# EAGLE design LED6Channels (EAGLE 6.5.0)
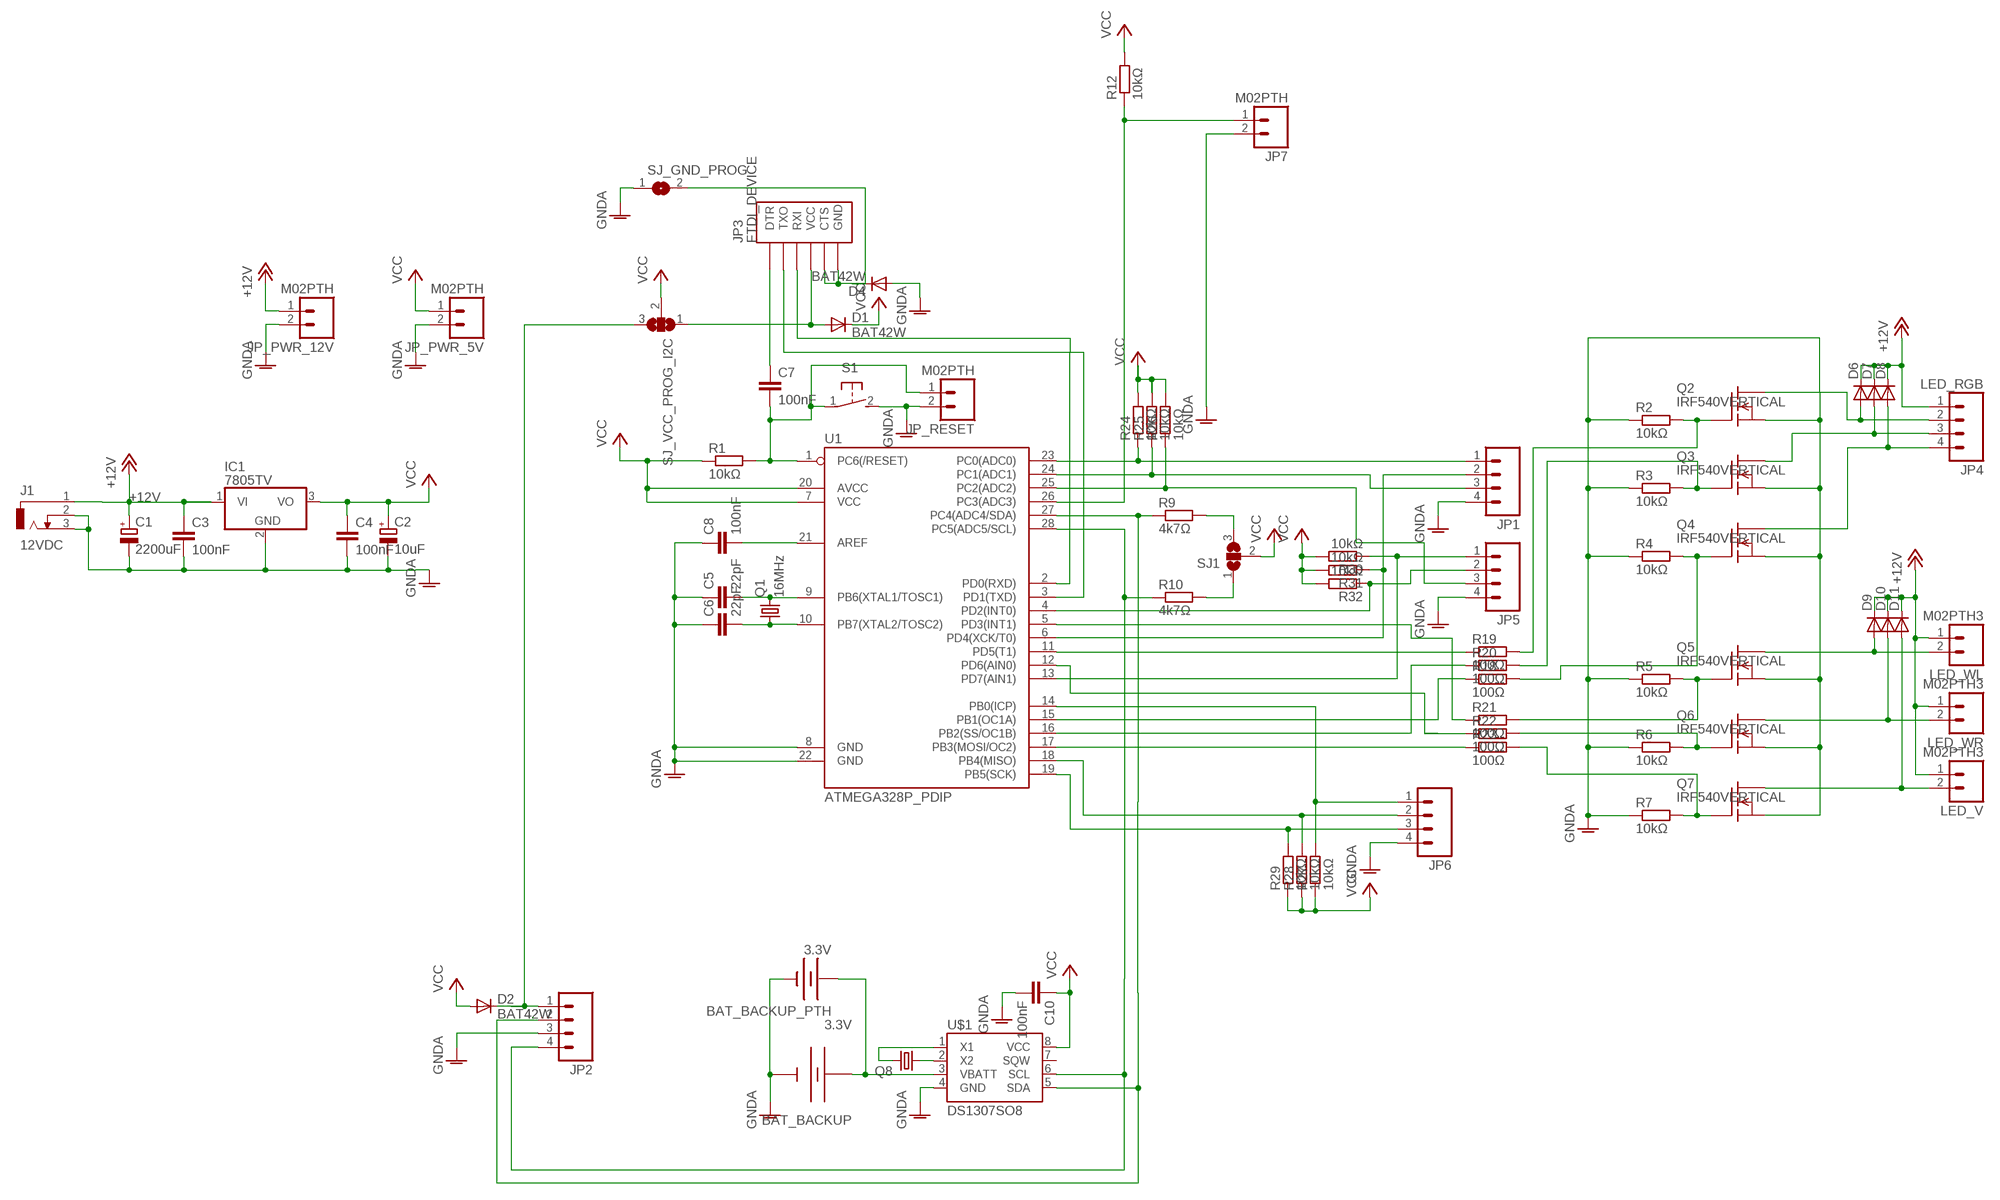
[diagram p0: schematic, sheet 1]

## Parts
BAT_BACKUP  3.3V  BATTERYNOVIAS  [S8421-45R-NOVIAS]
BAT_BACKUP_PTH  3.3V  BATTERY20PTH  [BATTCOM_20MM_PTH]
C1  2200uF  CPOL-EUE5-13  [E5-13]
C2  10uF  CPOL-EUE2-5  [E2-5]
C3  100nF  C-EU025-024X044  [C025-024X044]
C4  100nF  C-EU025-024X044  [C025-024X044]
C5  22pF  C-EU025-024X044  [C025-024X044]
C6  22pF  C-EU025-024X044  [C025-024X044]
C7  100nF  C-EU025-024X044  [C025-024X044]
C8  100nF  C-EU025-024X044  [C025-024X044]
C10  100nF  C-EU025-024X044  [C025-024X044]
D1  BAT42W  DIODE-SOD123  [SOD123]
D2  BAT42W  DIODE-SOD123  [SOD123]
D4  BAT42W  DIODE-SOD123  [SOD123]
D6  DIODE-DO201-05V  [DO201AD-05V]
D7  DIODE-DO201-05V  [DO201AD-05V]
D8  DIODE-DO201-05V  [DO201AD-05V]
D9  DIODE-DO201-05V  [DO201AD-05V]
D10  DIODE-DO201-05V  [DO201AD-05V]
D11  DIODE-DO201-05V  [DO201AD-05V]
IC1  7805TV  [TO220V]
J1  12VDC  DCJ0303  [DCJ0303]
JP1  M04LONGPADS  [1X04_LONGPADS]
JP2  M04LONGPADS  [1X04_LONGPADS]
JP3  FTDI_DEVICE  [FTDI_DEVICE_SIDE]
JP4  LED_RGB  M04LONGPADS  [1X04_LONGPADS]
JP5  M04LONGPADS  [1X04_LONGPADS]
JP6  M04LONGPADS  [1X04_LONGPADS]
JP7  M02PTH  [1X02]
JP_PWR_5V  M02PTH  [1X02]
JP_PWR_12V  M02PTH  [1X02]
JP_RESET  M02PTH  [1X02]
LED_V  M02PTH3  [1X02_LONGPADS]
LED_WL  M02PTH3  [1X02_LONGPADS]
LED_WR  M02PTH3  [1X02_LONGPADS]
Q1  16MHz  CRYSTALHC49S  [HC49/S]
Q2  IRF540VERTICAL  [TO220V]
Q3  IRF540VERTICAL  [TO220V]
Q4  IRF540VERTICAL  [TO220V]
Q5  IRF540VERTICAL  [TO220V]
Q6  IRF540VERTICAL  [TO220V]
Q7  IRF540VERTICAL  [TO220V]
Q8  CRYSTALTC26H  [TC26H]
R1  10kΩ  R-EU_0207/10  [0207/10]
R2  10kΩ  R-EU_0207/10  [0207/10]
R3  10kΩ  R-EU_0207/10  [0207/10]
R4  10kΩ  R-EU_0207/10  [0207/10]
R5  10kΩ  R-EU_0207/10  [0207/10]
R6  10kΩ  R-EU_0207/10  [0207/10]
R7  10kΩ  R-EU_0207/10  [0207/10]
R9  4k7Ω  R-EU_0207/10  [0207/10]
R10  4k7Ω  R-EU_0207/10  [0207/10]
R12  10kΩ  R-EU_0207/10  [0207/10]
R18  100Ω  R-EU_0207/10  [0207/10]
R19  100Ω  R-EU_0207/10  [0207/10]
R20  100Ω  R-EU_0207/10  [0207/10]
R21  100Ω  R-EU_0207/10  [0207/10]
R22  100Ω  R-EU_0207/10  [0207/10]
R23  100Ω  R-EU_0207/10  [0207/10]
R24  10kΩ  R-EU_0207/10  [0207/10]
R25  10kΩ  R-EU_0207/10  [0207/10]
R26  10kΩ  R-EU_0207/10  [0207/10]
R27  10kΩ  R-EU_0207/10  [0207/10]
R28  10kΩ  R-EU_0207/10  [0207/10]
R29  10kΩ  R-EU_0207/10  [0207/10]
R30  10kΩ  R-EU_0207/10  [0207/10]
R31  10kΩ  R-EU_0207/10  [0207/10]
R32  10kΩ  R-EU_0207/10  [0207/10]
S1  31-XX  [B3F-31XX]
SJ1  SJ2W  [SJ_2]
SJ_GND_PROG  SJ  [SJ]
SJ_VCC_PROG_I2C  SJ2W  [SJ_2]
U1  ATMEGA328P_PDIP  [DIL28-3]
U$1  DS1307SO8  [SO08]

## Nets
+12V [+12V]: C1.+ C3.1 D6.C D7.C D8.C D9.C D10.C D11.C IC1.1(VI) J1.1 JP4.1 JP_PWR_12V.1 LED_V.1 LED_WL.1 LED_WR.1
E1_BUTTON: JP1.3 R25.1 U1.24(PC1(ADC1))
E1_L: JP1.1 R24.1 U1.23(PC0(ADC0))
E1_R: JP5.3 R26.1 U1.25(PC2(ADC2))
E2_BUTTON: JP1.2 R31.1 U1.6(PD4(XCK/T0))
E2_L: JP5.2 R32.1 U1.4(PD2(INT0))
E2_R: JP5.1 R30.1 U1.13(PD7(AIN1))
GNDA: BAT_BACKUP.2(-) BAT_BACKUP_PTH.2(-) C1.- C2.- C3.2 C4.2 C5.1 C6.1 C8.1 C10.2 D4.A IC1.2(GND) J1.2 J1.3 JP1.4 JP2.3 JP5.4 JP6.4 JP7.2 JP_PWR_5V.2 JP_PWR_12V.2 JP_RESET.2 Q2.3(S) Q3.3(S) Q4.3(S) Q5.3(S) Q6.3(S) Q7.3(S) R2.1 R3.1 R4.1 R5.1 R6.1 R7.1 S1.2(S) SJ_GND_PROG.1 U1.8(GND) U1.22(GND) U$1.4(GND)
N$1: Q7.1(G) R7.2 R23.2
N$2: R23.1 U1.17(PB3(MOSI/OC2))
N$3: Q6.1(G) R6.2 R22.2
N$4: R20.1 U1.16(PB2(SS/OC1B))
N$5: R18.1 U1.15(PB1(OC1A))
N$6: R21.1 U1.5(PD3(INT1))
N$7: Q3.1(G) R3.2 R20.2
N$8: Q2.1(G) R2.2 R19.2
N$11: D10.A LED_WR.2 Q6.2(D)
N$12: D9.A LED_WL.2 Q5.2(D)
N$13: D11.A LED_V.2 Q7.2(D)
N$14: D6.A JP4.2 Q2.2(D)
N$15: D7.A JP4.3 Q3.2(D)
N$17: C8.2 U1.21(AREF)
N$20: JP6.2 R28.2 U1.18(PB4(MISO))
N$21: JP6.3 R29.2 U1.19(PB5(SCK))
N$22: JP6.1 R27.2 U1.14(PB0(ICP))
N$30: Q5.1(G) R5.2 R21.2
N$31: R19.1 U1.11(PD5(T1))
N$32: R22.1 U1.12(PD6(AIN0))
N$33: Q4.1(G) R4.2 R18.2
N$34: D8.A JP4.4 Q4.2(D)
OSC1: C5.2 Q1.2 U1.9(PB6(XTAL1/TOSC1))
OSC2: C6.2 Q1.1 U1.10(PB7(XTAL2/TOSC2))
P_GND: D4.C JP3.P$5(CTS) JP3.P$6(GND) SJ_GND_PROG.2
P_RESET: C7.1 JP3.P$1(DTR)
P_RX: JP3.P$3(RXI) U1.2(PD0(RXD))
P_TX: JP3.P$2(TXO) U1.3(PD1(TXD))
P_VCC: D1.A JP3.P$4(VCC) SJ_VCC_PROG_I2C.1
PIN_EXTRA: JP7.1 R12.1 U1.26(PC3(ADC3))
RESET: C7.2 JP_RESET.1 R1.2 S1.1(P) U1.1(PC6(/RESET))
SCL: JP2.4 R10.1 U1.28(PC5(ADC5/SCL)) U$1.6(SCL)
SCL_PULLUP_JUMP: R10.2 SJ1.1
SDA: JP2.2 R9.1 U1.27(PC4(ADC4/SDA)) U$1.5(SDA)
SDA_PULLUP_JUMP: R9.2 SJ1.3
VBAT: BAT_BACKUP.1(+) BAT_BACKUP_PTH.1(+) U$1.3(VBATT)
VCC: C2.+ C4.1 C10.1 D1.C D2.A IC1.3(VO) JP_PWR_5V.1 R1.1 R12.2 R24.2 R25.2 R26.2 R27.1 R28.1 R29.1 R30.2 R31.2 R32.2 SJ1.2 SJ_VCC_PROG_I2C.2 U1.7(VCC) U1.20(AVCC) U$1.8(VCC)
VCC_I2C: D2.C JP2.1 SJ_VCC_PROG_I2C.3
X1: Q8.2 U$1.1(X1)
X2: Q8.1 U$1.2(X2)
Unconnected: U$1.7(SQW)

## Library data of the parts
BAT_BACKUP = harwin:BATTERY: Harwin Coin cell battery holder S8421-45R
BAT_BACKUP_PTH = SparkFun-Electromechanical:BATTERY: Battery Holders Various common sizes : AA, AAA, 20mm coin cell and 12mm coin cell. 20MM_4LEGS, BATT-10373
C1 C2 = resistor:CPOL-EU: POLARIZED CAPACITOR, European symbol
C3-C8 C10 = rcl:C-EU: CAPACITOR, European symbol
D1 D2 D4 = diode:DIODE-: DIODE diameter 5.2 mm, vertical, grid 5.08 / 7.62 /10.16 mm. Diode positioned at cathode(default) anode(-A)
D6-D11 = diodes-vertical:DIODE-: DIODE diameter 5.2 mm, vertical, grid 5.08 / 7.62 /10.16 mm. Diode positioned at cathode(default) anode(-A)
IC1 = linear:78*: Positive VOLTAGE REGULATOR Source: http://cache.national.com/ds/LM/LM78L05.pdf http://www.fairchildsemi.com/ds/LM/LM7805.pdf
J1 = con-jack:DCJ0303: DC POWER JACK Source: DCJ0303.pdf; OC_FARNELL: unknown; OC_NEWARK: unknown
JP1 JP2 JP4-JP6 = SparkFun-Connectors:M04: Header 4 Standard 4-pin 0.1" header. Use with straight break away headers (SKU : PRT-00116), right angle break away headers (PRT-00553), swiss pins (PRT-00743), machine pins (PRT-00117), and female headers (PRT-00115). Molex polarized connector foot print use with SKU : PRT-08231 with associated crimp pins and housings. 1MM SMD Version SKU: PRT-10208
JP3 = SparkFun-Connectors:FTDI_DEVICE: Connector which mates to FTDI basic or FTDI cable.
JP7 JP_PWR_5V JP_PWR_12V JP_RESET LED_V LED_WL LED_WR = SparkFun-Connectors:M02: Standard 2-pin 0.1" header. Use with - straight break away headers ( PRT-00116) - right angle break away headers (PRT-00553) - swiss pins (PRT-00743) - machine pins (PRT-00117) - female headers (PRT-00115) Molex polarized connector foot print use with: PRT-08233 with associated crimp pins and housings. 2.54_SCREWTERM for use with PRT-10571. 3.5mm Screw Terminal footprints for PRT-08084 5mm Screw Terminal footprints for use with PRT-08432
Q1 = crystal:CRYSTAL: CRYSTAL; OC_FARNELL: 1667008; OC_NEWARK: unknown
Q2-Q7 = IRF540Nvertical:IRF540: N-Channel Enhancement MOSFET (HEXFET); 100V; 28A; 0,077Ohm
Q8 = crystal:CRYSTAL: CRYSTAL; OC_FARNELL: unknown; OC_NEWARK: unknown
R1-R7 R9 R10 R12 R18-R32 = rcl:R-EU_: RESISTOR, European symbol
S1 = switch-omron:31-XX: OMRON SWITCH; MPN: B3F-3100; OC_FARNELL: 959704; OC_NEWARK: 36M3582
SJ1 SJ_VCC_PROG_I2C = jumper:SJ2W: SMD solder JUMPER
SJ_GND_PROG = jumper:SJ: SMD solder JUMPER
U1 = SparkFun-DigitalIC:ATMEGA328P_PDIP: uC used in the Arduino 32kb flash, 1k EEPROM, 2k SRAM This is the through-hole version of this chip.
U$1 = SparkFun-FreqCtrl:DS1307: I2C real-time clock with battery backup.

## Net classes
1 ground: width 0.406 mm
2 +12V: width 1.219 mm

## Board
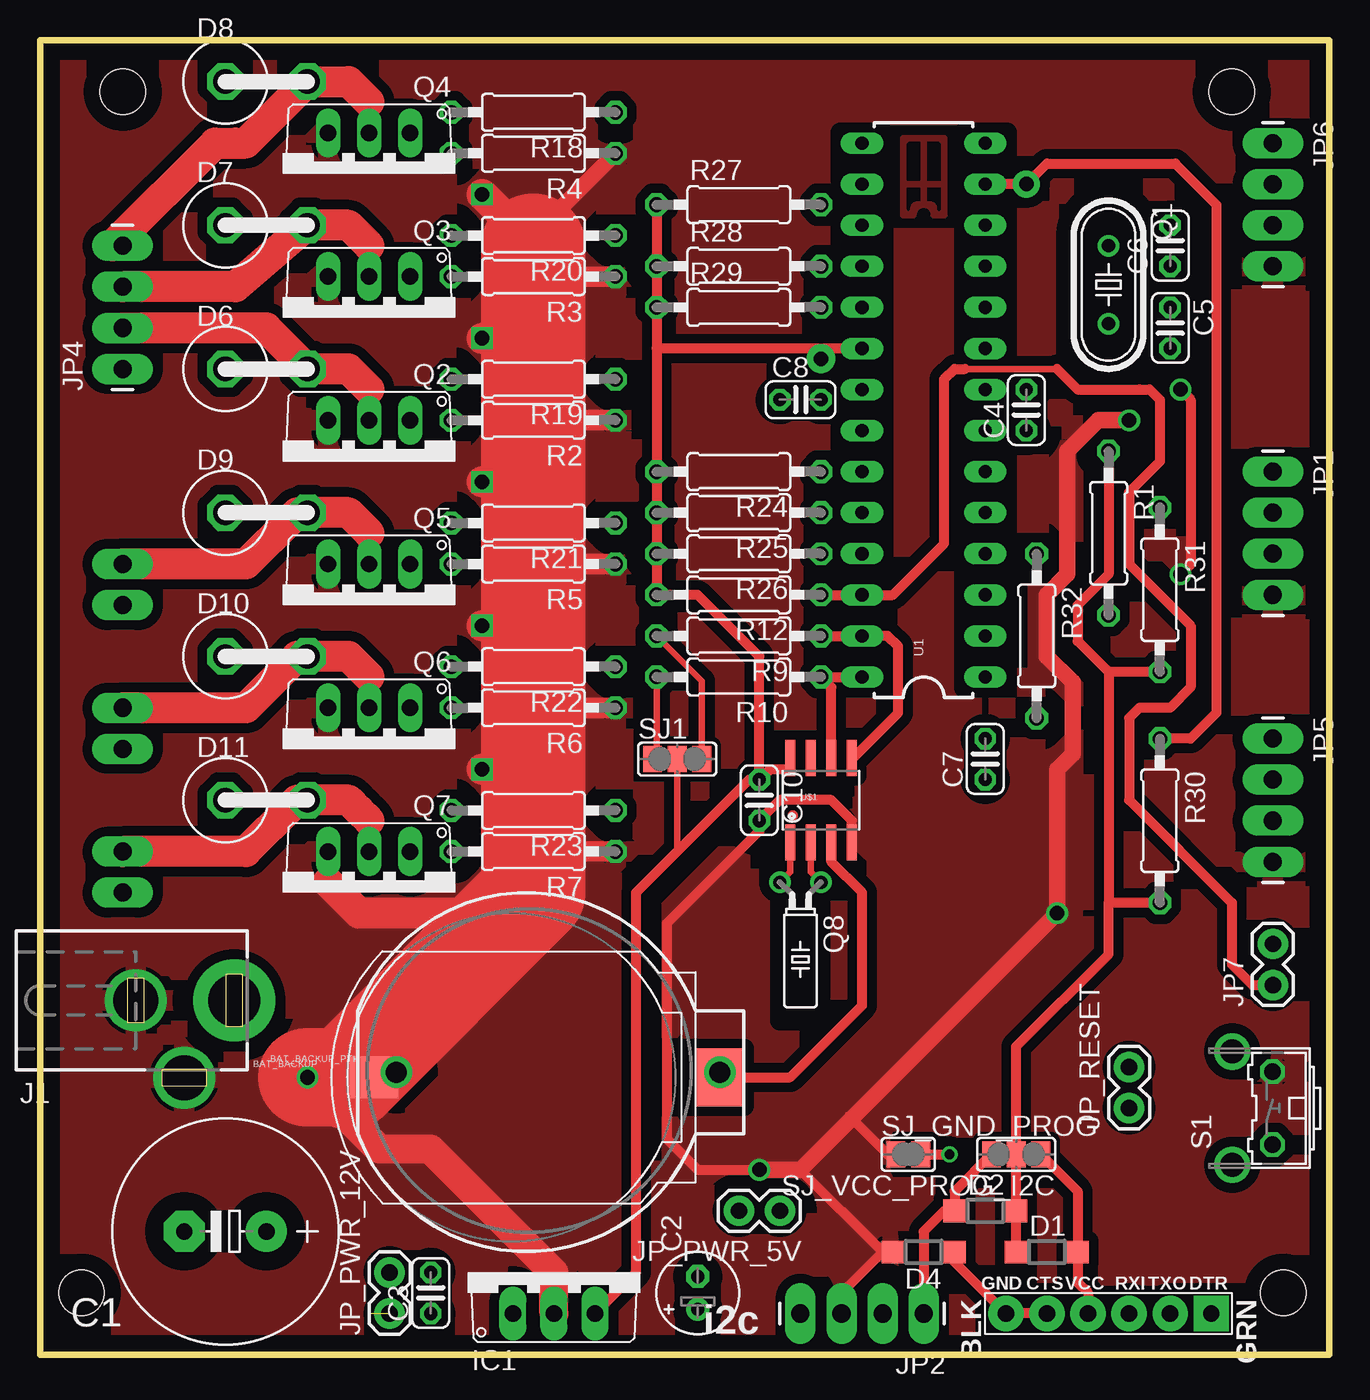
[diagram p1: board, top side]
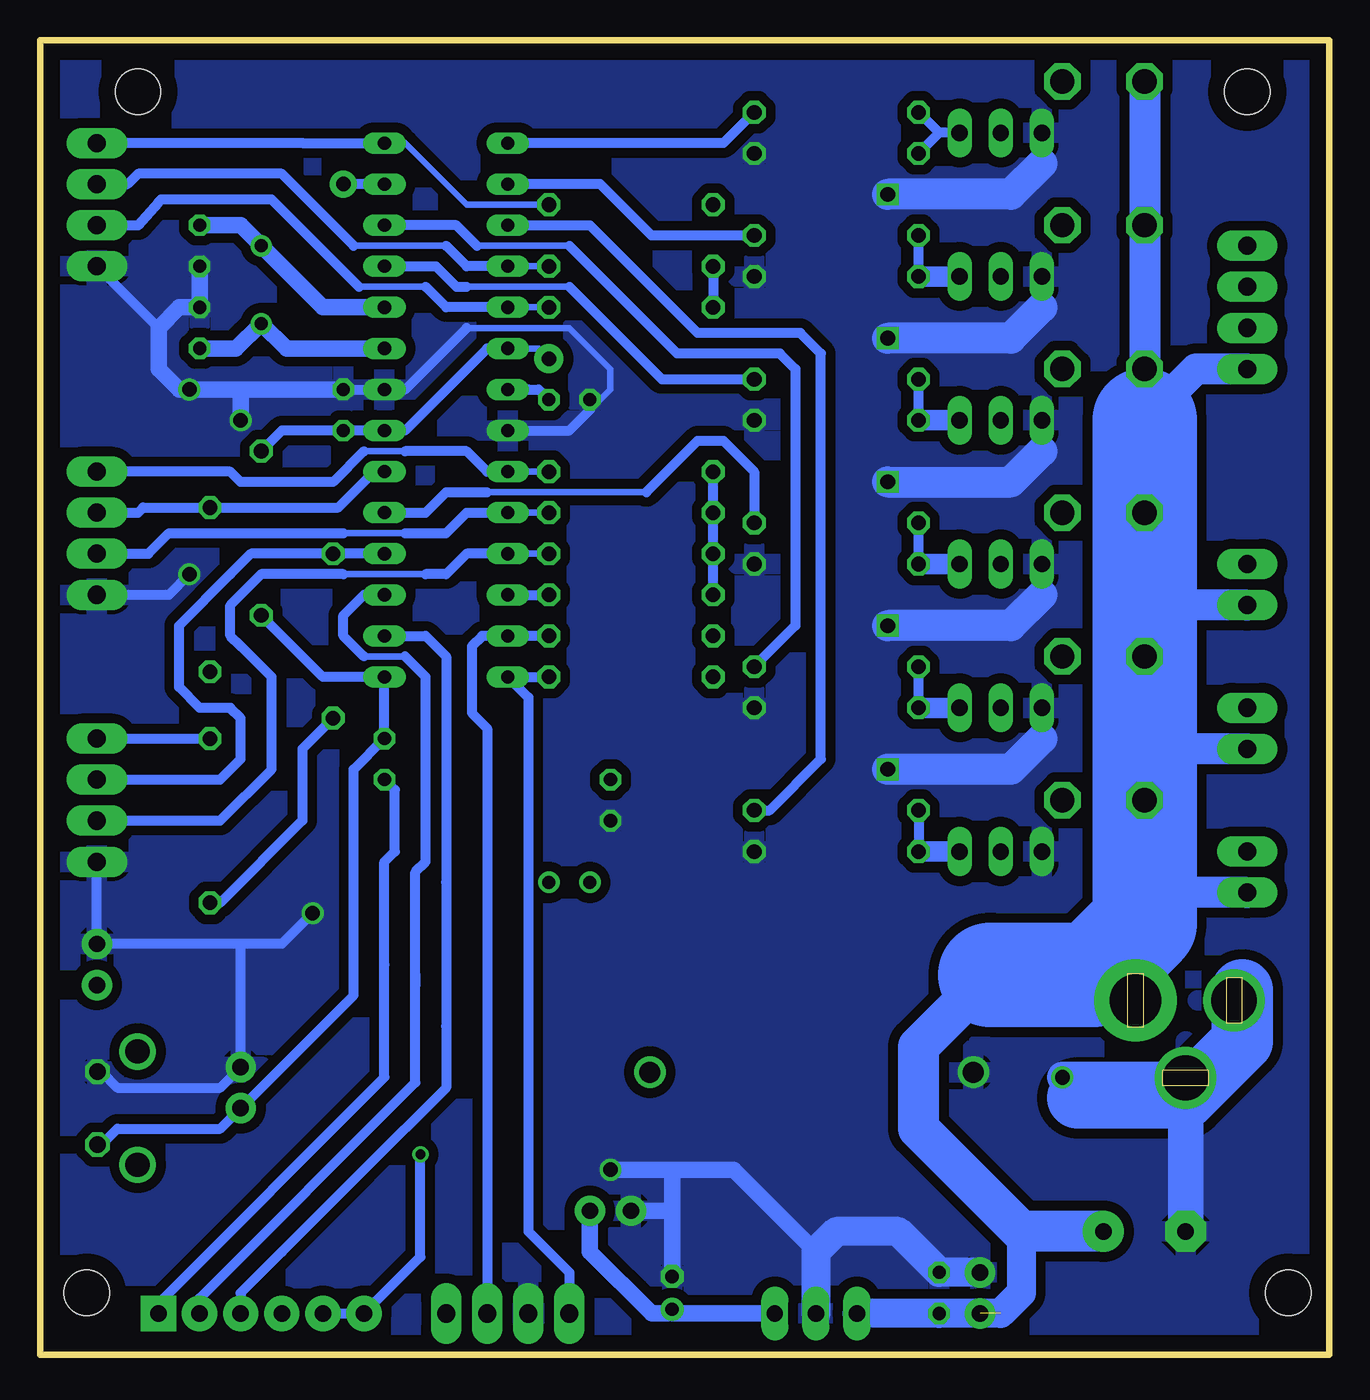
[diagram p2: board, bottom side, seen from below]

Size 79.69 x 81.28 mm. Coordinates in mm from the lower left corner, seen from the top.
Outline: 0,0 79.68,0
Outline: 79.68,0 79.68,81.27 0,81.27 0,0
Outline: 0,0 0,81.28 79.69,81.28 79.69,0 79.68,0
Outline: 79.68,0 0,0
Copper layers (1*16): Top 0.035mm / dielectric 1.5mm / Bottom 0.035mm
Design rules "default": minimum track width 10mil, minimum drill 24mil, track to track 8mil, track to pad 8mil, pad to pad 8mil, via to via 8mil, smd to smd 8mil, copper to edge 40mil, drill to drill 8mil, minimum pad ring 10mil, minimum via ring 8mil, stop-mask expansion 4mil, vias tented up to drill 0mil, thermal gap 10mil
Holes 2.8 mm at 5.08,78.11 73.66,78.11 76.83,3.81 2.54,3.81
tRestrict: area 45.7,20.6 to 48.3,28.6

### Footprints (pad centres in the part's own frame; a part is rotated, then mirrored left to right if it is on the bottom)
S8421-45R-NOVIAS = smd 3 x 3.6: 1 12.9,0 | smd 3 x 2.6: 2 -8.5,0
BATTCOM_20MM_PTH = drill 1.3: 1 11.85,0; 2 -8.15,0
E5-13 = drill 1.016 pad 2.54: + -2.54,0 | drill 1.016 pad 2.54 octagon: - 2.54,0
E2-5 = drill 0.813 pad 1.422: + -1.016,0 | drill 0.813 pad 1.422 octagon: - 1.016,0
C025-024X044 = drill 0.813 octagon: 1 -1.27,0; 2 1.27,0
SOD123 = smd 1.4 x 1.4: A 1.9,0; C -1.9,0
DO201AD-05V = drill 1.5 octagon: A 2.54,0; C -2.54,0
TO220V = drill 1.016 pad 1.676 long: 1 -2.54,-2.54; 2 0,-2.54; 3 2.54,-2.54
DCJ0303 = drill 3.2 pad 5.08: 1 0,3.1 | drill 2.8 pad 3.81: 2 4.8,0; 3 0,-3
1X04_LONGPADS = drill 1.118 pad 1.88 long: 1 0,0; 2 2.54,0; 3 5.08,0; 4 7.62,0
FTDI_DEVICE_SIDE = drill 1.016 pad 2.184 square: P$1 -6.35,0 | drill 1.016 pad 2.184: P$2 -3.81,0; P$3 -1.27,0; P$4 1.27,0; P$5 3.81,0; P$6 6.35,0
1X02 = drill 1.016 pad 1.88: 1 0,0; 2 2.54,0
1X02_LONGPADS = drill 1.118 pad 1.88 long: 1 0,0; 2 2.54,0
HC49/S = drill 0.813: 1 -2.413,0; 2 2.413,0
TO220V' = drill 1.016 long: 1 -2.54,-2.54; 2 0,-2.54; 3 2.54,-2.54
TC26H = drill 0.813: 1 -1.27,0; 2 1.27,0
0207/10 = drill 0.9 octagon: 1 -5.08,0; 2 5.08,0
B3F-31XX = drill 1.016 octagon: 1 -2.261,-1.245; 2 2.261,-1.245 | drill 1.499 pad 2.159: 3 -3.505,1.245; 4 3.505,1.245
SJ_2 = smd 1.168 x 1.6: 1 -1.524,0; 2 0,0; 3 1.524,0
SJ = smd 1.168 x 1.6: 1 -0.762,0; 2 0.762,0
DIL28-3 = drill 0.813 long: 1 -16.51,-3.81; 2 -13.97,-3.81; 3 -11.43,-3.81; 4 -8.89,-3.81; 5 -6.35,-3.81; 6 -3.81,-3.81; 7 -1.27,-3.81; 8 1.27,-3.81; 9 3.81,-3.81; 10 6.35,-3.81; 11 8.89,-3.81; 12 11.43,-3.81; 13 13.97,-3.81; 14 16.51,-3.81; 15 16.51,3.81; 16 13.97,3.81; 17 11.43,3.81; 18 8.89,3.81; 19 6.35,3.81; 20 3.81,3.81; 21 1.27,3.81; 22 -1.27,3.81; 23 -3.81,3.81; 24 -6.35,3.81; 25 -8.89,3.81; 26 -11.43,3.81; 27 -13.97,3.81; 28 -16.51,3.81
SO08 = smd 0.61 x 2.21: 1 -1.905,-2.616; 2 -0.635,-2.616; 3 0.635,-2.616; 4 1.905,-2.616; 5 1.905,2.616; 6 0.635,2.616; 7 -0.635,2.616; 8 -1.905,2.616

### Placement (x,y rotation side)
BAT_BACKUP  29.11,17.14 0 top
BAT_BACKUP_PTH  30.16,17.46 0 top
C1  11.43,7.62 180 top
C2  40.64,3.81 90 top
C3  24.13,3.81 90 top
C4  60.96,58.42 90 top
C5  69.85,63.5 270 top
C6  69.85,68.58 90 top
C7  58.42,36.83 90 top
C8  46.99,59.05 0 top
C10  44.45,34.29 270 top
D1  62.23,6.35 0 top
D2  58.42,8.89 0 top
D4  54.61,6.35 180 top
D6  13.97,60.96 0 top
D7  13.97,69.85 0 top
D8  13.97,78.74 0 top
D9  13.97,52.07 0 top
D10  13.97,43.18 0 top
D11  13.97,34.29 0 top
IC1  31.75,5.08 0 top
J1  8.89,21.91 270 top
JP1  76.2,54.61 270 top
JP2  54.61,2.54 180 top
JP3  66.04,2.54 180 top
JP4  5.08,60.96 90 top
JP5  76.2,38.1 270 top
JP6  76.2,74.93 270 top
JP7  76.2,22.86 90 top
JP_PWR_5V  45.72,8.89 180 top
JP_PWR_12V  21.59,2.54 90 top
JP_RESET  67.31,15.24 90 top
LED_V  5.08,28.57 90 top
LED_WL  5.08,46.35 90 top
LED_WR  5.08,37.47 90 top
Q1  66.04,66.17 270 top
Q2  IRF540VERTICAL  [TO220V']  20.32,55.24 180 top
Q3  IRF540VERTICAL  [TO220V']  20.32,64.14 180 top
Q4  IRF540VERTICAL  [TO220V']  20.32,73.03 180 top
Q5  IRF540VERTICAL  [TO220V']  20.32,46.35 180 top
Q6  IRF540VERTICAL  [TO220V']  20.32,37.47 180 top
Q7  IRF540VERTICAL  [TO220V']  20.32,28.57 180 top
Q8  46.99,29.21 180 top
R1  66.04,50.8 270 top
R2  30.48,57.78 180 top
R3  30.48,66.67 180 top
R4  30.48,74.3 180 top
R5  30.48,48.9 180 top
R6  30.48,40.01 180 top
R7  30.48,31.11 180 top
R9  43.18,44.45 180 top
R10  43.18,41.91 180 top
R12  43.18,46.99 180 top
R18  30.48,76.83 180 top
R19  30.48,60.33 180 top
R20  30.48,69.22 180 top
R21  30.48,51.44 180 top
R22  30.48,42.55 180 top
R23  30.48,33.66 180 top
R24  43.18,54.61 180 top
R25  43.18,52.07 180 top
R26  43.18,49.53 180 top
R27  43.18,71.12 0 top
R28  43.18,67.31 0 top
R29  43.18,64.77 0 top
R30  69.21,33.02 270 top
R31  69.21,47.31 270 top
R32  61.6,44.45 270 top
S1  74.93,15.24 90 top
SJ1  39.37,36.83 0 top
SJ_GND_PROG  53.66,12.38 0 top
SJ_VCC_PROG_I2C  60.33,12.38 180 top
U1  54.61,58.42 90 top
U$1  48.26,34.29 0 top

### Tracks (layer width: path | path; a pad name or v marks a point on that pad's centre or on a via)
+12V  (1 unrouted)
  Bottom 0.406: 14.61,23.5 13.65,23.5 12.06,21.91 | D6.C 11.43,57.78 | D9.C 11.43,57.15 | D10.C 11.43,45.72 | D11.C 11.43,36.83
  Bottom 1.219: J1.1 12.7,22.86 14.61,23.5
  Bottom 1.778: 19.05,7.62 19.05,3.81 20.32,2.54 C3.1 IC1.1
  Bottom 1.93: LED_WR.1 11.43,37.47 | LED_WL.1 11.43,46.35 | LED_V.1 11.43,28.57 | JP4.1 8.26,60.96 11.43,57.78 | 9.53,52.07 11.43,57.78 | 11.43,57.78 D7.C D8.C
  Bottom 2.54: C1.+ 19.05,7.62 25.4,13.97 25.4,19.05 20.95,23.5
  Bottom 6.452: 20.95,23.5 14.61,23.5 11.43,26.67 11.43,28.57 D11.C 11.43,36.83 11.43,37.47 D10.C 11.43,45.72 11.43,46.35 D9.C 11.43,57.15 11.43,57.78
E1_BUTTON
  Bottom 0.406: 60.96,50.8 57.15,50.8 | U1.24 R25.1
  Bottom 0.61: 60.96,50.8 71.75,50.8 73.02,49.53 JP1.3 | 57.15,50.8 54.61,50.8 53.34,52.07 U1.24
E1_L
  Bottom 0.406: 52.07,54.61 U1.23 R24.1 | 57.15,55.88 59.69,55.88
  Bottom 0.61: 52.07,54.61 53.34,55.88 57.15,55.88 | 59.69,55.88 61.6,53.98 67.31,53.98 67.94,54.61 JP1.1
E1_R
  Bottom 0.406: 55.88,48.26 60.96,48.26 | U1.25 R26.1
  Bottom 0.61: U1.25 53.34,49.53 54.61,48.26 55.88,48.26 | 60.96,48.26 66.04,48.26 67.94,46.35 67.94,44.45 67.31,43.81 65.41,41.91 65.41,38.73 65.41,36.2 68.58,33.02 JP5.3
E2_BUTTON
  Bottom 0.406: 59.05,54.61 U1.6
  Bottom 0.61: JP1.2 73.66,52.07 73.34,52.39 R31.1 61.28,52.39 59.05,54.61
E2_L
  Bottom 0.61: U1.4 R32.1 66.67,49.53 67.94,48.26 71.12,45.09 71.12,41.27 69.85,40.01 67.94,40.01 67.31,39.37 67.31,36.83 68.58,35.56 JP5.2
E2_R  (via drill 0.9 pad 1.68)
  Top 0.61: R30.1 71.12,38.1 72.71,39.69 72.71,71.12 70.17,73.66 62.23,73.66 v60.96,72.39 U1.13
  Bottom 0.61: U1.13 v60.96,72.39 | JP5.1 R30.1
FILLER
  pour Top (isolate 0.61, rank 3): 0,0 79.69,0 79.69,81.28 0,81.28
FILLER_BOTTOM
  pour Bottom (isolate 0.61, rank 3): 0,0 79.69,0 79.69,81.28 0,81.28
GNDA  (via drill 0.6, 0.9)
  Top 0.406: Q7.3 17.78,29.21 | BAT_BACKUP.2 19.05,17.14 19.05,17.46 BAT_BACKUP_PTH.2 | D4.A 52.07,6.35
  Top 0.61: JP2.3 49.53,3.81 52.07,6.35 46.99,11.43 | U$1.4 50.17,33.02 48.9,34.29 45.72,34.29 C10.2 44.45,32.38 38.74,26.67 38.74,13.34 40.64,11.43 v44.45,11.43 | v70.48,59.69 71.12,59.05 71.12,48.9 v70.48,48.26 | SJ_GND_PROG.1 52.39,12.38 50.17,14.61
  Top 1.016: v44.45,11.43 46.99,11.43 50.17,14.61 v62.87,27.3 62.87,36.2 63.82,37.15 63.82,41.59 62.23,43.18 62.23,46.99 63.5,48.26 63.5,55.88 65.41,57.78 v67.31,57.78 | R4.1 30.48,69.22 30.48,68.58
  Top 1.27: R5.1 30.48,48.9 | R6.1 30.48,40.01 | R2.1 30.48,57.78 | R3.1 31.75,66.67 30.48,68.58 | R7.1 30.48,31.11
  Top 1.778: IC1.2 31.75,5.08 24.13,12.7 20.95,12.7 v16.51,17.14
  Top 1.93: v27.3,36.2 30.48,36.2 | 17.78,29.21 19.68,27.3 29.84,27.3 30.48,28.57 | v27.3,45.09 30.48,45.09 | v27.3,62.87 30.48,62.87 | v27.3,71.75 30.48,68.58 | 30.48,53.98 v27.3,53.98
  Top 6.096: 19.05,17.14 v16.51,17.14
  Top 6.452: 30.48,68.58 30.48,62.87 30.48,57.78 30.48,53.98 30.48,48.9 30.48,45.09 30.48,40.01 30.48,36.2 30.48,31.11 30.48,28.57 19.05,17.14
  Bottom 0.254: 8.89,12.7 8.89,13.97 11.75,16.83 | J1.3 6.03,20 8.89,17.14 J1.2
  Bottom 0.406: 8.89,17.46 16.19,17.46 v16.51,17.14 | 6.03,20.32 5.71,20.32 5.87,20.48 5.87,21.91 | 53.34,63.5 46.99,63.5 44.45,60.96 44.45,59.69 45.09,59.05 C8.1 | Q3.3 17.78,64.77 | 17.78,38.1 Q6.3 | 17.78,46.99 Q5.3 | Q2.3 17.78,55.88
  Bottom 0.61: C4.2 U1.8 57.15,59.69 53.34,63.5 | U1.22 46.99,57.15 45.72,58.42 C8.1 | 17.78,73.66 Q4.3 | JP6.4 72.39,63.5 | 67.31,25.4 JP7.2 JP5.4 | v62.87,27.3 64.77,25.4 67.31,25.4 | v70.48,48.26 71.75,46.99 JP1.4 | S1.2 75.92,17.5 74.93,16.51 68.58,16.51 JP_RESET.2 67.31,25.4
  Bottom 1.016: C6.1 C5.1 71.12,64.77 72.39,63.5 72.39,60.96 71.12,59.69 v70.48,59.69 67.31,59.69 | C4.2 67.31,59.69 | v67.31,57.78 67.31,59.69 | 31.75,6.35 36.83,11.43 40.64,11.43 | C2.- 40.64,8.89 | 40.64,8.89 40.64,11.43 | 40.64,11.43 v44.45,11.43 | JP_PWR_5V.2 40.64,8.89
  Bottom 1.778: IC1.2 31.75,6.35 30.48,7.62 26.67,7.62 C3.2 JP_PWR_12V.2
  Bottom 1.93: 17.78,38.1 19.68,36.2 v27.3,36.2 | 17.78,46.99 19.68,45.09 v27.3,45.09 | 17.78,55.88 19.68,53.98 v27.3,53.98 | 17.78,64.77 19.68,62.87 v27.3,62.87 | 17.78,73.66 19.68,71.75 v27.3,71.75 | 5.71,20.32 8.89,17.14 | 8.89,17.14 v16.51,17.14 | 8.89,17.14 8.89,16.51
  Bottom 2.184: 8.89,16.51 8.89,12.7 C1.-
  pour Top (isolate 1.27, rank 3): 0,0 79.69,0 79.69,81.28 0,81.28
  pour Bottom (isolate 0.61, rank 3): 0,0 79.69,0 79.69,81.28 0,81.28
N$1
  Bottom 0.61: R23.2 R7.2
  Bottom 1.27: Q7.1 R7.2
N$2
  Bottom 0.406: R23.1 34.93,33.66
  Bottom 0.61: R23.1 34.61,33.66 31.43,36.83 31.43,61.91 32.7,63.18 39.05,63.18 45.72,69.85 U1.17
N$3
  Bottom 0.61: R6.2 R22.2
  Bottom 1.27: Q6.1 R6.2
N$4
  Bottom 0.61: R20.1 41.91,69.22 45.09,72.39 U1.16
N$5
  Bottom 0.61: R18.1 37.47,74.93 U1.15
N$6
  Bottom 0.406: 52.07,53.34 46.99,53.34 42.23,53.34
  Bottom 0.61: U1.5 55.88,52.07 54.61,53.34 52.07,53.34 | 42.23,53.34 39.05,56.52 37.47,56.52 35.56,54.61 R21.1
N$7
  Bottom 0.61: R3.2 R20.2
  Bottom 1.27: Q3.1 R3.2
N$8
  Bottom 0.61: R2.2 R19.2
  Bottom 1.27: Q2.1 R2.2
N$11
  Top 0.406: Q6.2 20.32,41.91 | D10.A 15.88,43.18 15.56,42.86
  Top 1.93: 20.32,41.91 19.05,43.18 D10.A 15.88,43.18 15.56,42.86 12.7,40.01 LED_WR.2
N$12
  Top 0.406: Q5.2 20.32,50.8 | D9.A 15.88,52.07 15.56,51.75
  Top 1.93: 20.32,50.8 19.05,52.07 D9.A 15.88,52.07 15.56,51.75 12.7,48.9 LED_WL.2
N$13
  Top 0.406: Q7.2 20.32,33.02 | D11.A 15.88,34.29 15.56,33.97
  Top 1.93: 20.32,33.02 19.68,33.66 19.05,34.29 D11.A 15.88,34.29 15.56,33.97 12.7,31.11 LED_V.2
N$14
  Top 0.406: Q2.2 20.32,59.69
  Top 1.93: 20.32,59.69 19.05,60.96 D6.A 13.97,63.5 JP4.2
N$15
  Top 0.406: Q3.2 20.32,68.58
  Top 1.93: 20.32,68.58 19.05,69.85 D7.A 12.06,66.04 JP4.3
N$17
  Bottom 0.61: U1.21 49.53,59.69 48.9,59.69 C8.2
N$20
  Bottom 0.406: 54.61,68.58 60.33,68.58 | U1.18 R28.2
  Bottom 0.61: 60.33,68.58 64.77,73.03 73.66,73.03 74.3,72.39 JP6.2 | U1.18 53.34,67.31 54.61,68.58
N$21
  Bottom 0.406: 55.88,66.04 60.01,66.04 | U1.19 R29.2
  Bottom 0.61: U1.19 54.61,64.77 55.88,66.04 | 60.01,66.04 65.41,71.44 72.23,71.44 72.39,71.28 73.66,69.85 JP6.3
N$22
  Bottom 0.406: R27.2 53.34,71.12 57.15,74.93 U1.14
  Bottom 0.61: U1.14 63.5,74.93 71.12,74.93 72.39,74.93 74.93,74.93 JP6.1
N$29
  Bottom 3.81: 15.56,15.88 8.89,15.88 5.4,19.37 5.4,22.54
N$30
  Bottom 0.61: R5.2 R21.2
  Bottom 1.27: Q5.1 R5.2
N$31
  Bottom 0.406: 53.34,66.04 46.99,66.04
  Bottom 0.61: U1.11 55.25,67.31 53.98,66.04 53.34,66.04 | 46.99,66.04 41.28,60.33 R19.1
N$32
  Bottom 0.406: 46.99,68.58 52.71,68.58
  Bottom 0.61: 46.99,68.58 40.32,61.91 33.97,61.91 33.02,60.96 33.02,45.09 R22.1 | 52.71,68.58 53.98,69.85 U1.12
N$33
  Bottom 0.61: Q4.1 24.13,75.56 | 24.13,75.56 R4.2 | 24.13,75.56 R18.2
N$34
  Top 0.406: 20.32,77.47 Q4.2 | JP4.4 4.45,68.58
  Top 1.93: 4.45,68.58 10.79,74.93 12.06,74.93 12.7,74.93 D8.A 19.05,78.74 20.32,77.47
N$35
  pour Top (isolate 0.61, no thermals, hatched): 55.25,70.48 arc90 54.61,71.12 arc90 53.98,70.48 53.34,70.48 53.34,75.25 55.88,75.25 55.88,70.48
OSC1
  Bottom 1.016: U1.9 64.45,62.23 Q1.2 67.63,62.23 C5.2
OSC2
  Bottom 1.016: U1.10 62.23,64.77 Q1.1 67.31,69.85 C6.2
P_GND  (via drill 0.6)
  Top 0.61: JP3.P$5 JP3.P$6 57.15,5.08 56.52,5.71 D4.C | SJ_GND_PROG.2 v56.2,12.38
  Bottom 0.61: JP3.P$5 JP3.P$6 56.2,6.03 v56.2,12.38
P_RESET
  Bottom 0.61: JP3.P$1 72.39,3.17 58.42,17.14 58.42,24.13 58.42,30.48 57.79,31.11 57.79,34.92 C7.1
P_RX
  Bottom 0.61: U1.2 55.88,44.45 54.61,43.18 54.61,29.21 54.61,20.32 54.61,16.51 59.69,11.43 64.77,6.35 67.31,3.81 JP3.P$3
P_TX
  Bottom 0.406: 57.15,43.18 59.69,43.18 | 59.69,46.99 U1.3
  Bottom 0.61: JP3.P$2 69.85,3.49 56.52,16.83 56.52,22.86 | 56.52,22.86 56.52,23.5 56.52,22.86 | 56.52,22.86 56.52,29.84 55.88,30.48 55.88,41.91 57.15,43.18 | 59.69,43.18 60.96,44.45 60.96,45.72 59.69,46.99
P_VCC
  Top 0.61: JP3.P$4 64.77,3.81 64.14,4.45 D1.A 64.13,10.1 SJ_VCC_PROG_I2C.1
PIN_EXTRA
  Top 0.406: 57.15,60.96 59.69,60.96 62.87,60.96
  Top 0.61: R12.1 U1.26 52.71,46.99 55.88,50.16 55.88,60.33 56.52,60.96 57.15,60.96 | 62.87,60.96 64.14,59.69 67.94,59.69 68.58,59.69 69.21,59.05 69.21,55.24 68.58,54.61 67.31,53.34 67.31,53.02 67.31,48.9 71.12,45.09 71.12,41.27 69.85,40.01 67.94,40.01 67.31,39.37 67.31,34.29 73.66,27.94 73.66,24.13 74.93,22.86 JP7.1
  Bottom 0.61: U1.26 R12.1
RESET
  Bottom 0.61: R1.2 62.23,41.91 U1.1 C7.2 60.33,36.2 60.33,22.23 JP_RESET.1 68.58,13.97 74.93,13.97 75.92,12.98 S1.1
SCL
  Top 0.61: U1.28 R10.1 48.9,41.27 U$1.6
  Bottom 0.61: R10.1 U1.28 49.53,40.64 49.53,7.62 46.99,5.08 JP2.4
SCL_PULLUP_JUMP
  Top 0.406: R10.2 38.1,40.01 38.1,36.83 SJ1.1
SDA
  Top 0.61: R9.1 U1.27 52.39,44.45 53.02,43.81 53.02,39.69 50.24,36.91 U$1.5
  Bottom 0.61: R9.1 U1.27 52.39,44.45 53.02,43.81 53.02,39.69 52.07,38.73 JP2.2
SDA_PULLUP_JUMP
  Top 0.406: R9.2 40.01,42.55 40.89,41.66 SJ1.3
VBAT
  Top 0.406: BAT_BACKUP_PTH.1 BAT_BACKUP.1
  Top 0.61: BAT_BACKUP.1 46.36,17.14 50.8,21.59 50.8,28.57 48.9,30.48 U$1.3
VCC  (via drill 0.9 pad 1.78)
  Top 0.406: U$1.8 46.36,36.2 | D1.C | SJ1.2 39.37,31.11 | 60.32,7.62 60.33,7.62 | D2.A 60.33,7.62 D2.A 60.33,8.26 D2.A | D2.A | v48.26,61.59 48.26,62.23
  Top 0.61: 66.04,27.94 66.04,24.77 60.33,19.05 60.33,12.7 | R1.1 66.04,48.26 64.14,46.35 64.14,44.13 66.04,42.23 | 66.04,42.23 66.04,27.94 | IC1.3 36.83,5.08 36.83,28.57 39.37,31.11 43.82,35.56 C10.1 | 38.1,62.23 R29.1 R28.1 R27.1 | 38.1,62.23 R24.2 R25.2 R26.2 R12.2 40.64,46.99 44.45,43.18 C10.1 | R30.2 66.04,27.94 | R31.2 66.04,42.23 | 46.36,36.2 45.09,36.2 C10.1 | U1.20 48.26,62.23 38.1,62.23 | D1.C 60.32,7.62 | D2.A SJ_VCC_PROG_I2C.2 | SJ_VCC_PROG_I2C.2 60.33,12.7 | 60.33,7.62 D2.A | SJ_VCC_PROG_I2C.2 60.33,12.7
  Bottom 0.406: v48.26,61.59 48.9,62.23 U1.20 | 40.64,2.54 C2.+
  Bottom 0.61: U1.20 52.07,62.23 57.15,57.15 U1.7 C4.1 64.77,57.15 R1.1 | R12.2 R26.2 R25.2 R24.2 | R32.2 63.5,37.47 63.5,33.02 68.58,27.94 R30.2 | R28.1 R29.1
  Bottom 0.813: C2.+ 40.64,2.54
  Bottom 1.016: IC1.3 40.64,2.54 | JP_PWR_5V.1 45.72,6.35 41.91,2.54 40.89,2.54 C2.+
VCC_I2C
  Top 0.406: D2.C 55.88,8.89
  Top 0.61: JP2.1 54.61,3.17 54.61,7.62 55.88,8.89 | SJ_VCC_PROG_I2C.3 56.52,10.1 D2.C
X1
  Top 0.406: Q8.2 46.36,29.84 46.36,30.96 U$1.1
X2
  Top 0.406: Q8.1 47.62,29.84 U$1.2
(copper drawn outside any net)
  shapes: Top circle x1

### Text on the board
tNames: i2c
tRestrict: 10k | 10k | 10k
tTekst: UUSim - May'15 | 100 | rgb | 10k | 10k | 10k | - | 10k | DL | +12V | DR | 10k | Left | 10k | 10k | 10k | - | + | 10k | 10k | 4k7 | 10k | Right | 4k7 | DV | - | i2c | + | pu | Front | 10k | - | + | 3,3V Bat | Px | 12V DC | btn | prog & i2c | extra pin | reset | 5V | reverse protection | - | + | prog | 12V | C-D+ | -c+rtd | - | - | - | + | + | +
bTekst: LED-Controller | Slaap / lekker